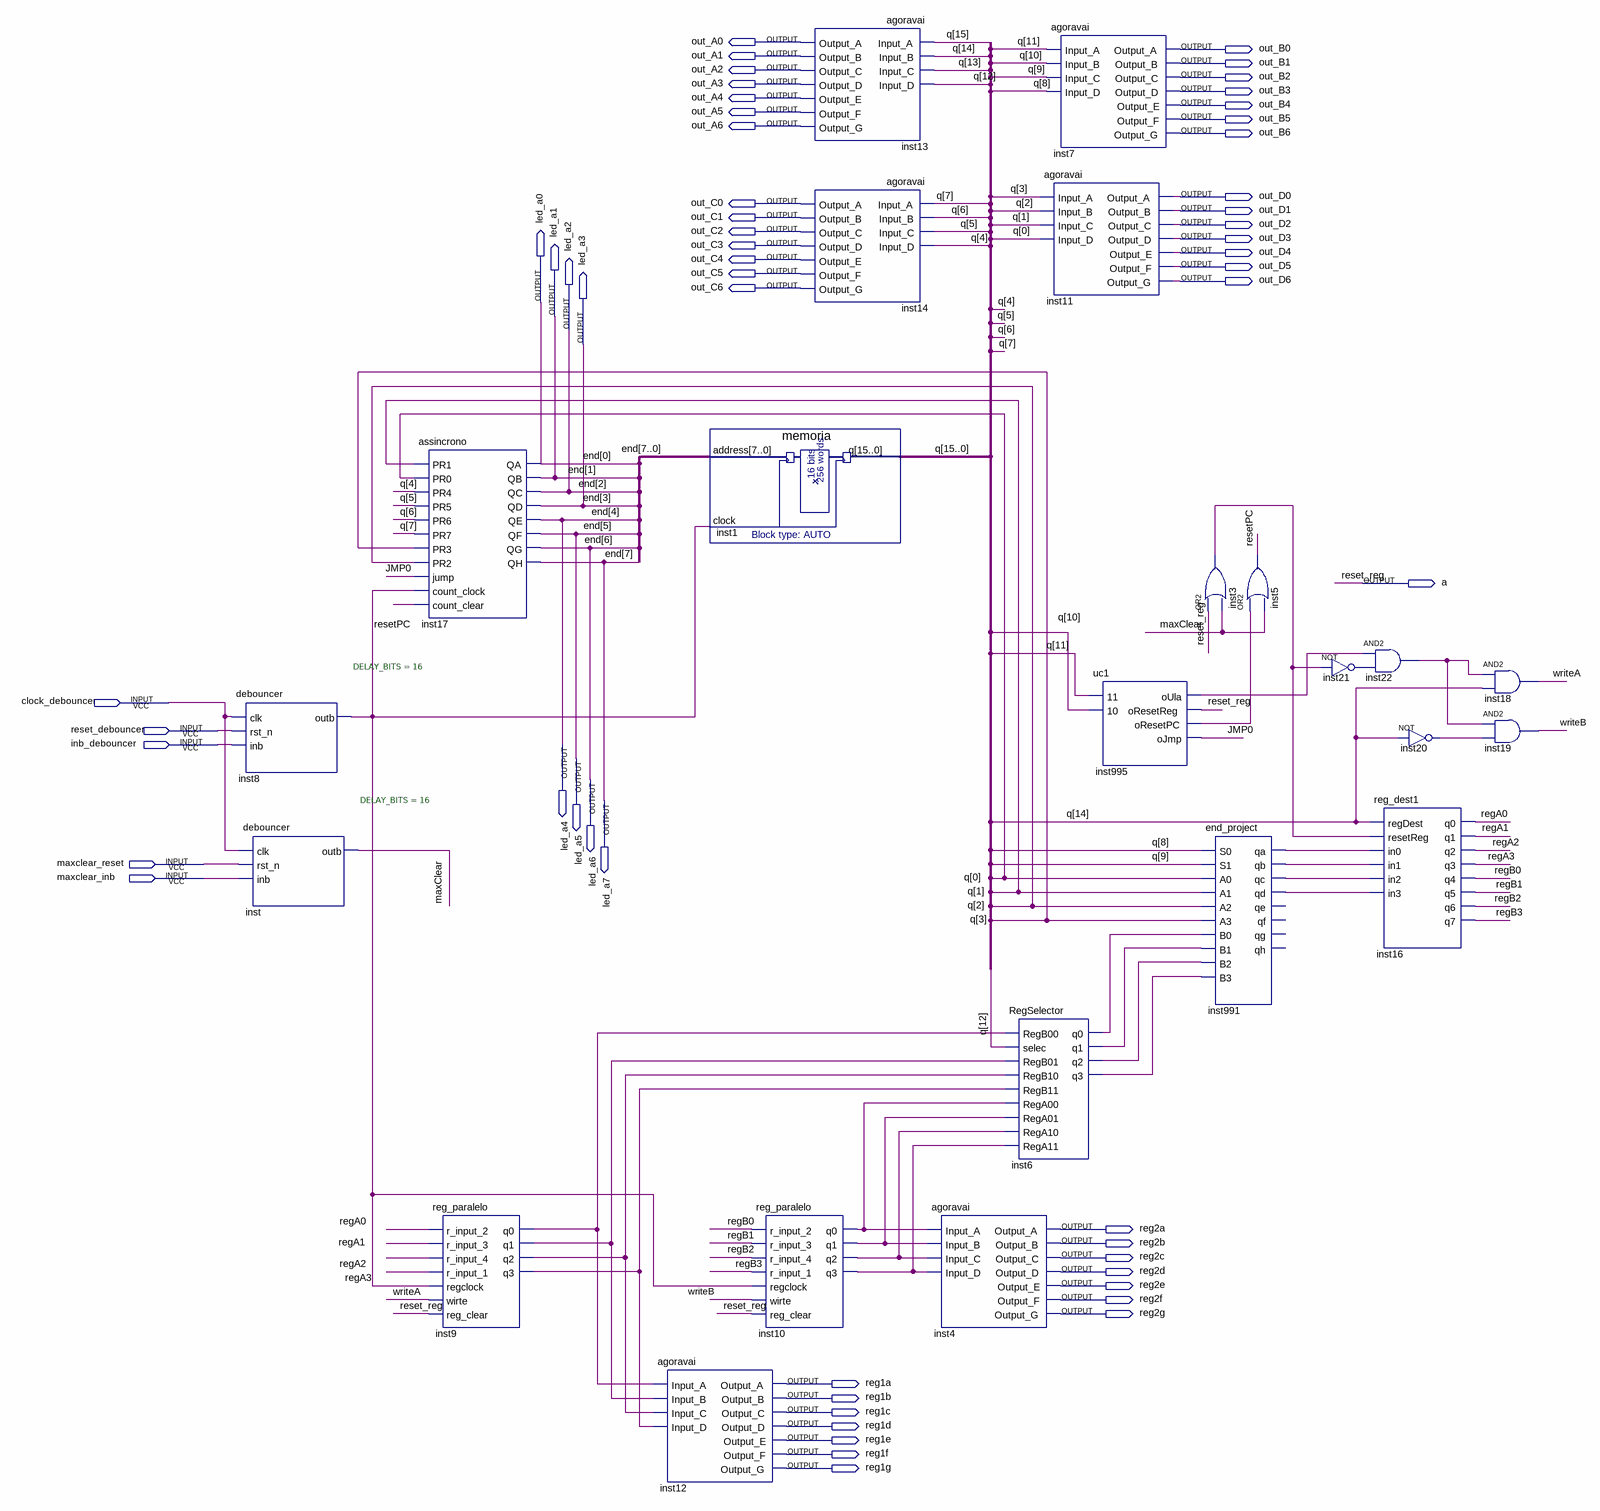
[diagram p0: schematic sheet]
// Quartus schematic projeto_final_cpu.bdf as structural Verilog: 23 symbols, 56 pins
module projeto_final_cpu (
  input  clock_debouncer,
  input  reset_debouncer,
  input  inb_debouncer,
  input  maxclear_reset,
  input  maxclear_inb,
  output out_A0,
  output out_B0,
  output out_A1,
  output out_B1,
  output out_A2,
  output out_B2,
  output out_A3,
  output out_B3,
  output out_A4,
  output out_B4,
  output out_A5,
  output out_B5,
  output out_A6,
  output out_B6,
  output out_D0,
  output out_C0,
  output out_D1,
  output out_C1,
  output out_D2,
  output out_C2,
  output out_D3,
  output out_C3,
  output out_D4,
  output out_C4,
  output out_D5,
  output out_C5,
  output out_D6,
  output out_C6,
  output led_a0,
  output led_a1,
  output led_a2,
  output led_a3,
  output a,
  output led_a4,
  output led_a5,
  output led_a6,
  output led_a7,
  output reg2a,
  output reg2b,
  output reg2c,
  output reg2d,
  output reg2e,
  output reg2f,
  output reg2g,
  output reg1a,
  output reg1b,
  output reg1c,
  output reg1d,
  output reg1e,
  output reg1f,
  output reg1g
);

  wire inst3_out, inst6_q0, inst6_q1, inst6_q2, inst6_q3, inst8_outb, inst9_q0, inst9_q1, inst9_q2, inst9_q3,
       inst10_q0, inst10_q1, inst10_q2, inst10_q3, inst20_out, inst21_out, inst22_out, inst991_qa,
       inst991_qb, inst991_qc, inst991_qd, inst995_oresetpc, inst995_oula, JMP0, maxClear, regA0, regA1,
       regA2, regA3, regB0, regB1, regB2, regB3, resetPC, writeA, writeB;
  wire [15:0] q;

  debouncer #(.DELAY_BITS(16)) inst8 (
    .clk(clock_debouncer), .rst_n(reset_debouncer), .inb(inb_debouncer), .outb(inst8_outb));
  debouncer #(.DELAY_BITS(16)) inst (
    .clk(clock_debouncer), .rst_n(maxclear_reset), .inb(maxclear_inb), .outb(maxClear));
  assincrono inst17 (
    .PR1(q[1]), .PR0(q[0]), .PR4(q[4]), .PR5(q[5]), .PR6(q[6]), .PR7(q[7]), .PR3(q[3]), .PR2(q[2]),
    .jump(JMP0), .count_clock(inst8_outb), .count_clear(resetPC), .QA(led_a0), .QB(led_a1), .QC(led_a2),
    .QD(led_a3), .QE(led_a4), .QF(led_a5), .QG(led_a6), .QH(led_a7));
  reg_paralelo inst9 (
    .r_input_2(regA0), .r_input_3(regA1), .r_input_4(regA2), .r_input_1(regA3), .regclock(inst8_outb),
    .wirte(writeA), .reg_clear(a), .q0(inst9_q0), .q1(inst9_q1), .q2(inst9_q2), .q3(inst9_q3));
  agoravai inst12 (
    .Input_A(inst9_q0), .Input_B(inst9_q1), .Input_C(inst9_q2), .Input_D(inst9_q3), .Output_A(reg1a),
    .Output_B(reg1b), .Output_C(reg1c), .Output_D(reg1d), .Output_E(reg1e), .Output_F(reg1f), .Output_G(reg1g));
  memoria inst1 (.address({led_a7, led_a6, led_a5, led_a4, led_a3, led_a2, led_a1, led_a0}), .clock(inst8_outb), .q(q));
  reg_paralelo inst10 (
    .r_input_2(regB0), .r_input_3(regB1), .r_input_4(regB2), .r_input_1(regB3), .regclock(inst8_outb),
    .wirte(writeB), .reg_clear(a), .q0(inst10_q0), .q1(inst10_q1), .q2(inst10_q2), .q3(inst10_q3));
  agoravai inst13 (
    .Input_A(q[15]), .Input_B(q[14]), .Input_C(q[13]), .Input_D(q[12]), .Output_A(out_A0), .Output_B(out_A1),
    .Output_C(out_A2), .Output_D(out_A3), .Output_E(out_A4), .Output_F(out_A5), .Output_G(out_A6));
  agoravai inst14 (
    .Input_A(q[7]), .Input_B(q[6]), .Input_C(q[5]), .Input_D(q[4]), .Output_A(out_C0), .Output_B(out_C1),
    .Output_C(out_C2), .Output_D(out_C3), .Output_E(out_C4), .Output_F(out_C5), .Output_G(out_C6));
  agoravai inst4 (
    .Input_A(inst10_q0), .Input_B(inst10_q1), .Input_C(inst10_q2), .Input_D(inst10_q3), .Output_A(reg2a),
    .Output_B(reg2b), .Output_C(reg2c), .Output_D(reg2d), .Output_E(reg2e), .Output_F(reg2f), .Output_G(reg2g));
  agoravai inst11 (
    .Input_A(q[3]), .Input_B(q[2]), .Input_C(q[1]), .Input_D(q[0]), .Output_A(out_D0), .Output_B(out_D1),
    .Output_C(out_D2), .Output_D(out_D3), .Output_E(out_D4), .Output_F(out_D5), .Output_G(out_D6));
  RegSelector inst6 (
    .RegB00(inst9_q0), .selec(q[12]), .RegB01(inst9_q1), .RegB10(inst9_q2), .RegB11(inst9_q3),
    .RegA00(inst10_q0), .RegA01(inst10_q1), .RegA10(inst10_q2), .RegA11(inst10_q3), .q0(inst6_q0),
    .q1(inst6_q1), .q2(inst6_q2), .q3(inst6_q3));
  agoravai inst7 (
    .Input_A(q[11]), .Input_B(q[10]), .Input_C(q[9]), .Input_D(q[8]), .Output_A(out_B0), .Output_B(out_B1),
    .Output_C(out_B2), .Output_D(out_B3), .Output_E(out_B4), .Output_F(out_B5), .Output_G(out_B6));
  uc1 inst995 (
    .\11 (q[11]), .\10 (q[10]), .oUla(inst995_oula), .oResetReg(a), .oResetPC(inst995_oresetpc), .oJmp(JMP0));
  or inst3 (inst3_out, a, maxClear);
  end_project inst991 (
    .S0(q[8]), .S1(q[9]), .A0(q[0]), .A1(q[1]), .A2(q[2]), .A3(q[3]), .B0(inst6_q0), .B1(inst6_q1),
    .B2(inst6_q2), .B3(inst6_q3), .qa(inst991_qa), .qb(inst991_qb), .qc(inst991_qc), .qd(inst991_qd));  // open: qe, qf, qg, qh
  or inst5 (resetPC, inst995_oresetpc, maxClear);
  not inst21 (inst21_out, inst3_out);
  and inst22 (inst22_out, inst995_oula, inst21_out);
  reg_dest1 inst16 (
    .regDest(q[14]), .resetReg(inst3_out), .in0(inst991_qa), .in1(inst991_qb), .in2(inst991_qc),
    .in3(inst991_qd), .q0(regA0), .q1(regA1), .q2(regA2), .q3(regA3), .q4(regB0), .q5(regB1), .q6(regB2),
    .q7(regB3));
  not inst20 (inst20_out, q[14]);
  and inst18 (writeA, inst22_out, q[14]);
  and inst19 (writeB, inst22_out, inst20_out);

  // Other names for the same wires on the sheet: end[7:0] = {led_a7, led_a6, led_a5, led_a4, led_a3, led_a2, led_a1, led_a0};
  //   reset_reg = a
endmodule
